# EAGLE design circuit_1layer (EAGLE 9.4.2)
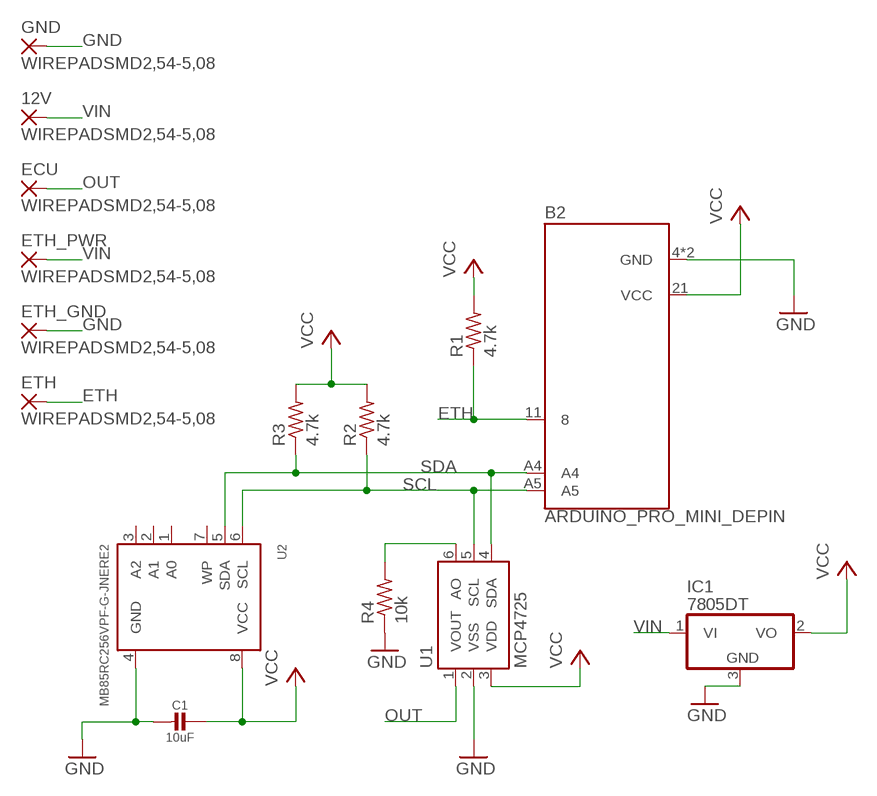
[diagram p0: schematic, sheet 1]

## Parts
12V  WIREPADSMD2,54-5,08  [SMD2,54-5,08]
B2  ARDUINO_PRO_MINI_DEPIN  [ARDUINO_PRO_MINI]
C1  10uF  CAP_CERAMIC_0805MP  [_0805MP]
ECU  WIREPADSMD2,54-5,08  [SMD2,54-5,08]
ETH  WIREPADSMD2,54-5,08  [SMD2,54-5,08]
ETH_GND  WIREPADSMD2,54-5,08  [SMD2,54-5,08]
ETH_PWR  WIREPADSMD2,54-5,08  [SMD2,54-5,08]
GND  WIREPADSMD2,54-5,08  [SMD2,54-5,08]
IC1  7805DT  [TO252]
R1  4.7k  R-US_R0603  [R0603]
R2  4.7k  R-US_R0603  [R0603]
R3  4.7k  R-US_R0603  [R0603]
R4  10k  R-US_R0603  [R0603]
U1  MCP4725  MCP4725SOT-23  [SOT23-6]
U2  MB85RC256VPF-G-JNERE2  FRAM_SOIC8_I2C  [SOIC8_208MIL]

## Nets
ETH: B2.11 ETH.1(P) R1.1
GND: B2.4(GND) B2.23(GND) C1.2 ETH_GND.1(P) GND.1(P) IC1.3(GND) R4.1 U1.2(VSS) U2.4(GND)
N$4: R4.2 U1.6(AO)
OUT: ECU.1(P) U1.1(VOUT)
SCL: B2.A5 R2.1 U1.5(SCL) U2.6(SCL)
SDA: B2.A4 R3.1 U1.4(SDA) U2.5(SDA)
VCC: B2.21(VCC) C1.1 IC1.2(VO) R1.2 R2.2 R3.2 U1.3(VDD) U2.8(VCC)
VIN: 12V.1(P) ETH_PWR.1(P) IC1.1(VI)
Unconnected: U2.1(A0) U2.2(A1) U2.3(A2) U2.7(WP)

## Library data of the parts
12V ECU ETH ETH_GND ETH_PWR GND = wirepad:WIREPAD: Wire PAD connect wire on PCB
B2 = SparkFun-Boards-revised:ARDUINO_PRO_MINI_DEPIN: SparkFun Pro Mini Pro Mini compatible footprint. Dimensions: 0.7 x 1.3" PCB Thickness: 0.8mm SparkFun Products: 3.3V/8MHz <https://www.sparkfun.com/products/11114> 5V/16MHz <https://www.sparkfun.com/products/11113>
C1 = microbuilder:CAP_CERAMIC: Ceramic Capacitors For new designs, use the packages preceded by an '_' character since they are more reliable: The following footprints should be used on most boards: _0402 - Standard footprint for regular board layouts _0603 - Standard footprint for regular board layouts _0805 - Standard footprint for regular board layouts _1206 - Standard footprint for regular board layouts For extremely tight-pitch boards where space is at a premium, the following 'micro-pitch' footprints can be used (smaller pads, no silkscreen outline, etc.): _0402MP - Micro-pitch footprint for very dense/compact boards _0603MP - Micro-pitch footprint for very dense/compact boards _0805MP - Micro-pitch footprint for very dense/compact boards _1206MP - Micro-pitch footprint for very dense/compact boards
IC1 = adafruit:78*: Positive VOLTAGE REGULATOR Added bigger pads to the TO-92 package
R1-R4 = adafruit:R-US_: RESISTOR, American symbol
U1 = SparkFun-IC-Conversion:MCP4725: MCP4725 DAC Microchip 12-bit I2C DAC, SOT23-6 Datasheet <https://cdn.sparkfun.com/datasheets/BreakoutBoards/MCP4725_2009.pdf> SparkFun Products SparkFun I2C DAC Breakout - MCP4725 <https://www.sparkfun.com/products/12918> (BOB-12918); PROD_ID: IC-08886
U2 = microbuilder:FRAM_SOIC8_I2C: I2C FRAM - SOIC8 Package 256KBit (32Kx8) - MB85RC256VPF-G-JNERE2 - SOIC-8 200 Mil, 2.7-5.5V, -40°C-85°C

## Board
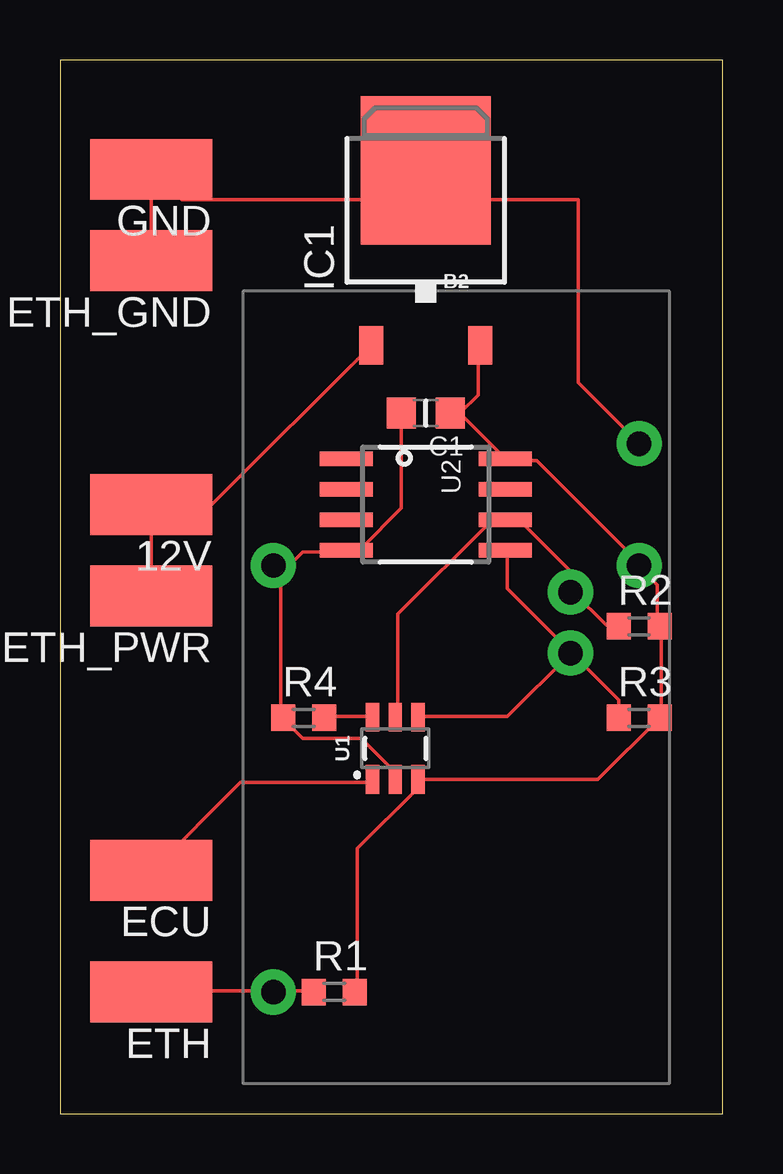
[diagram p1: board, top side]

Size 27.61 x 43.93 mm. Coordinates in mm from the lower left corner, seen from the top.
Outline: 0,0 27.61,0 27.61,43.93 0,43.93 0,0
Copper layers (1*16): Top 0.035mm / dielectric 1.5mm / Bottom 0.035mm
Design rules "default": minimum track width 6mil, minimum drill 0.35mm, track to track 6mil, track to pad 6mil, pad to pad 6mil, via to via 6mil, smd to smd 6mil, copper to edge 40mil, drill to drill 6mil, minimum pad ring 10mil, minimum via ring 8mil, stop-mask expansion 4mil, vias tented up to drill 0mil, thermal gap 10mil

### Footprints (pad centres in the part's own frame; a part is rotated, then mirrored left to right if it is on the bottom)
SMD2,54-5,08 = smd 2.54 x 5.08: 1 0,0
ARDUINO_PRO_MINI = drill 1.016 pad 1.88: 4 -7.62,5.08; 11 -7.62,-12.7; 21 7.62,5.08; 23 7.62,10.16; A4 4.763,1.429; A5 4.763,3.969
_0805MP = smd 1.2 x 1.3: 1 -1.016,0; 2 1.016,0
TO252 = smd 1 x 1.6: 1 -2.28,-4.8; 2 2.28,-4.8 | smd 5.4 x 6.2: 3 0,2.5
R0603 = smd 1 x 1.1: 1 -0.85,0; 2 0.85,0
SOT23-6 = smd 0.55 x 1.2: 1 0.95,1.3; 2 0,1.3; 3 -0.95,1.3; 4 -0.95,-1.3; 5 0,-1.3; 6 0.95,-1.3
SOIC8_208MIL = smd 0.6 x 2.2: 1 -1.905,-3.315; 2 -0.635,-3.315; 3 0.635,-3.315; 4 1.905,-3.315; 5 1.905,3.315; 6 0.635,3.315; 7 -0.635,3.315; 8 -1.905,3.315

### Placement (x,y rotation side)
12V  3.81,25.4 90 top
B2  16.51,17.78 0 top
C1  15.24,29.21 180 top
ECU  3.81,10.16 90 top
ETH  3.81,5.08 90 top
ETH_GND  3.81,35.56 90 top
ETH_PWR  3.81,21.59 90 top
GND  3.81,39.37 90 top
IC1  15.24,36.83 0 top
R1  11.43,5.08 0 top
R2  24.13,20.32 0 top
R3  24.13,16.51 0 top
R4  10.16,16.51 0 top
U1  13.97,15.24 180 top
U2  15.24,25.4 270 top

### Tracks (layer width: path | path; a pad name or v marks a point on that pad's centre or on a via)
ETH
  Top 0.152: 8.89,5.13 10.57,5.13 R1.1 | 8.89,5.13 3.86,5.13 ETH.1 | 8.89,5.13 B2.11
GND
  Top 0.152: B2.23 21.59,30.48 21.59,38.1 16.51,38.1 16.51,38.05 15.29,38.05 | ETH_GND.1 GND.1 5.08,38.1 15.24,38.1 15.29,38.05 | 15.29,38.05 15.29,39.27 IC1.3 15.29,38.05 | C1.2 14.22,25.25 12.55,23.57 11.94,23.57 U2.4 11.79,23.42 10.11,23.42 9.2,22.5 | 9.2,22.5 9.2,16.56 R4.1 9.35,16.41 10.11,15.65 12.55,15.65 13.92,14.27 13.92,13.97 U1.2 | 9.2,22.5 8.89,22.81 B2.4 9.2,22.5
N$4
  Top 0.152: R4.2 11.02,16.56 13,16.56 U1.6
OUT
  Top 0.152: U1.1 13,13.82 7.52,13.82 3.86,10.16 ECU.1
SCL
  Top 0.152: R2.1 23.22,20.37 22.76,20.37 21.39,21.74 B2.A5 21.23,21.9 21.23,22.66 19.25,24.64 18.64,24.64 U2.6 18.49,24.64 17.88,24.64 14.07,20.83 14.07,16.56 U1.5
SDA
  Top 0.152: R3.1 23.28,17.26 21.39,19.15 B2.A4 | U1.4 14.99,16.56 18.64,16.56 21.23,19.15 B2.A4 | U2.5 18.64,23.42 18.64,21.9 21.23,19.3 B2.A4
VCC
  Top 0.152: R1.2 12.39,5.13 12.39,11.07 14.83,13.51 14.83,13.82 U1.3 22.41,13.94 R3.2 25.04,16.51 25.04,20.22 R2.2 24.89,20.37 24.89,22.05 24.13,22.81 B2.21 24.13,22.96 19.86,27.23 18.64,27.23 U2.8 18.49,27.38 16.66,29.21 | 16.66,29.21 C1.1 16.36,29.21 | 16.66,29.21 17.42,29.97 17.42,31.95 IC1.2
VIN
  Top 0.152: ETH_PWR.1 12V.1 6.33,25.4 IC1.1